# Altium schematic sheet PowerTree.SchDoc
size A; SheetNumber: 8; SheetTotal: 8
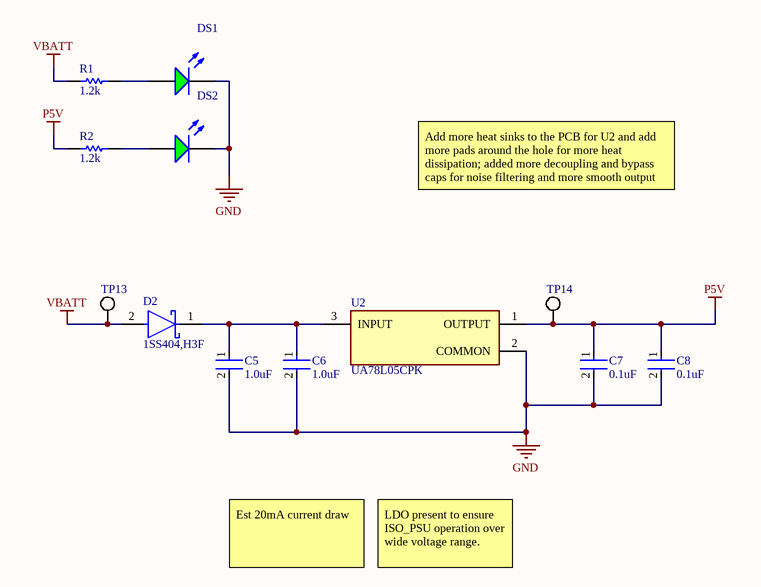
[diagram p0: PowerTree.SchDoc]

## Parts
C5  1.0uF  [FP-1206-L_3_2_0_2-W_1_6_0-IPC_A]
C6  1.0uF  [FP-1206-L_3_2_0_2-W_1_6_0-IPC_A]
C7  0.1uF  [FP-1206-L_3_2_0_2-W_1_6_0-IPC_C]
C8  0.1uF  [FP-1206-L_3_2_0_2-W_1_6_0-IPC_C]
D2  1SS404,H3F  [FP-SOD-323-MFG]
DS1  597-3311-407F  [DIAL-597-3311-407F_V]  (value not drawn)
DS2  597-3311-407F  [DIAL-597-3311-407F_V]  (value not drawn)
R1  1.2k  [RESC3216X70X50LL05T20]
R2  1.2k  [RESC3216X70X50LL05T20]
TP13  (no value)  [FOOTPRINT-GENERIC-TP-VIA-1MM]
TP14  (no value)  [FOOTPRINT-GENERIC-TP-VIA-1MM]
U2  UA78L05CPK  [FP-PK0003A-MFG]

## Nets
GND: C5.2 C6.2 C7.2 C8.2 DS1.2(K) DS2.2(K) U2.2(COMMON)
P5V: C7.1 C8.1 R2.1 TP14.1(TP) U2.1(OUTPUT)
VBATT: D2.2(A) R1.1 TP13.1(TP)
NetC5_1: C5.1 C6.1 D2.1(C) U2.3(INPUT)
NetDS1_1: DS1.1(A) R1.2
NetDS2_1: DS2.1(A) R2.2

## Notes on the sheet
- Add more heat sinks to the PCB for U2 and add more pads around the hole for more heat dissipation; added more decoupling and bypass caps for noise filtering and more smooth output
- Est 20mA current draw
- LDO present to ensure ISO_PSU operation over wide voltage range.

## Library data of the parts
C5 = CMP-2000-05866-2: General Purpose Ceramic Capacitor, 1206, 1uF, 10%, X7R, 15%, 50V; Manufacturer: Kyocera AVX; Manufacturer Part Number: 12065C105KAT2A; Dissipation Factor: 2.5%; Voltage: 25V; Multilayer: Yes; Dielectric: X7R; Radiation Hardening: No; Number of Pins: 2; Package Quantity: 1; Case Code (Metric): 3216; Thickness: 0.07inch; Voltage Rating (DC): 50V; Width: 0.063inch; Construction: Flat; Min Operating Temperature: -55°C; Length: 3.2mm; Voltage Rating: 50V; Case Code (Imperial): 1206; Height: 1.78mm; Capacitance: 1uF; REACH SVHC: No SVHC; Mount: Surface Mount; Max Operating Temperature: 125°C; Depth: 1.6mm; Packaging: Tape and Reel; Tolerance: 10%; Lead Free: Lead Free; Termination: SMD/SMT; RoHS Compliant: Yes; Case/Package: 1206; Contact Plating: Tin; Series: -; Supplier: Digikey; Supplier Part Number: 478-KGM31HR71H105KUCT-ND; RoHS: Yes; Category: Ceramic Capacitors; Stock: 33721; Pricing: 1=0.36, 10=0.212, 100=0.1385, 1000=0.10054, 2000=0.09094, 4000=0.08697, 6000=0.08446, 10000=0.08191, 14000=0.08036, 20000=0.07843, 50000=0.07526, 100000=0.07178 (USD); Mounting Technology: Surface Mount; Pins: 2; Dielectric Material: Ceramic; Package Shape: Rectangular; Terminal Finish: Nickel; Value: 1uF; Capacitor Type: Ceramic; Tolerance  (fill in as +-): 10%; Tolerance (fill in as +-): 10%; Rated DC Voltage (URdc): 50V; Temperature Characteristics Code: X7R; Package Style: SMTMeter; JESD-609 Code: e3; Reach SVHC Compliant: Yes; ComponentLink1URL: https://datasheet.ciiva.com:443/pdfs/VipMasterIC/IC/AVXC/AVXC-S-A0004824845/AVXC-S-A0004824845-1.pdf?src-supplier=IHS+Markit; ComponentLink1Description: https://datasheet.ciiva.com:443/pdfs/VipMasterIC/IC/AVXC/AVXC-S-A0004824845/AVXC-S-A0004824845-1.pdf?src-supplier=IHS+Markit
C6 = CMP-2000-05866-2: General Purpose Ceramic Capacitor, 1206, 1uF, 10%, X7R, 15%, 50V; Dissipation Factor: 2.5%; Voltage: 25V; Dielectric: X7R; Radiation Hardening: No; Number of Pins: 2; Package Quantity: 1; Case Code (Metric): 3216; Thickness: 0.07inch; Voltage Rating (DC): 50V; Width: 0.063inch; Construction: Flat; Min Operating Temperature: -55°C; Length: 3.2mm; Voltage Rating: 50V; Case Code (Imperial): 1206; Height: 1.78mm; Capacitance: 1uF; REACH SVHC: No SVHC; Mount: Surface Mount; Max Operating Temperature: 125°C; Depth: 1.6mm; Packaging: Tape and Reel; Tolerance: 10%; Lead Free: Lead Free; Termination: SMD/SMT; RoHS Compliant: Yes; Case/Package: 1206; Contact Plating: Tin; Series: -
C7 C8 = CMP-04427-013576-1: General Purpose Ceramic Capacitor, 1206, 100nF, 5%, X7R, 15%, 100V; Max Operating Temperature: 125°C; Depth: 1.6mm; Package Quantity: 1; Thickness: 0.05inch; Number of Pins: 2; Height: 1.27mm; Voltage Rating (DC): 100V; Radiation Hardening: No; Termination: SMD/SMT; Construction: Flat; REACH SVHC: No SVHC; Case/Package: 1206; Case Code (Imperial): 1206; Tolerance: 5%; Width: 0.063inch; Voltage: 100V; Packaging: Tape and Reel; Voltage Rating: 100V; Case Code (Metric): 3216; Capacitance: 100nF; Min Operating Temperature: -55°C; Length: 3.2mm; Dielectric: X7R; Mount: Surface Mount; Dielectric Material: Ceramic; Contact Plating: Tin; RoHS Compliant: Yes; Lead Free: Lead Free; Series: -
D2 = CMP-35905-000002-1: DIODE SCHOTTKY 20V 300MA USC; Max Repetitive Reverse Voltage (Vrrm): 25V; Element Configuration: Single; Mount: Surface Mount; Max Reverse Voltage (DC): 20V; Forward Current: 300mA; Packaging: Tape and Reel; Case/Package: SOD; Max Operating Temperature: 100°C; Min Operating Temperature: -40°C; Contact Plating: Tin; Average Rectified Current: 300mA
DS1 DS2 = CMP-007-00045-2: Single Color LED, Green, Water Clear, 2mm; Forward Voltage: 2.5V; Min Operating Temperature: -30°C; Max Operating Temperature: 85°C; Mounting Technology: Surface Mount; Pins: 2; RoHS Compliant: Yes
R1 R2 = CMP-2003-00061-1: Part Number: ERJ8ENF1201V; Manufacturer: Panasonic
TP13 TP14 = CMP-025-000000-1: Source: Generic.SchLib; Design Item ID: Misc-Generic-TP
U2 = CMP-2000-07341-2: IC REG LINEAR 5V 100MA SOT89-3; Manufacturer: Texas Instruments; Min Supply Voltage: 7V; Accuracy Percentage: 3.75%; Dropout Voltage: 1.7V; Number Of Outputs: 1; Nominal Supply Current: 3.8mA; Max Supply Voltage: 20V; Output Type: Fixed; Max Junction Temp: +125°C; Digikey Description: IC REG LINEAR 5V 100MA SOT89-3; RoHS: TRUE; ComponentLink2URL: https://www.ti.com/lit/ds/symlink/ua78l.pdf; Package: PK0003A; Temperature Range High: +125°C; Device Class L2: Power Management ICs; Manufacturer Part Number: UA78L05CPK; ComponentLink2Description: Datasheet; Category: IC; Lead Free: Yes; Automotive: No; Temperature Range Low: 0°C; Output Current: 100mA; Mouser Description: 100-mA, 30-V VIN, Positive-Voltage Linear Regulators 3-SOT-89 0 to 125; Device Class L3: Voltage Regulators - Linear; Device Class L1: Integrated Circuits (ICs); Temperature: 0°C to +125°C; Output Voltage: 5V; Height: 1.6mm; Octopart: https://octopart.com/ua78l05cpk-texas+instruments-525289